# Altium schematic sheet Tag_Lastmodulation_ESP32.SchDoc
size A4; SheetNumber: 10; SheetTotal: 10
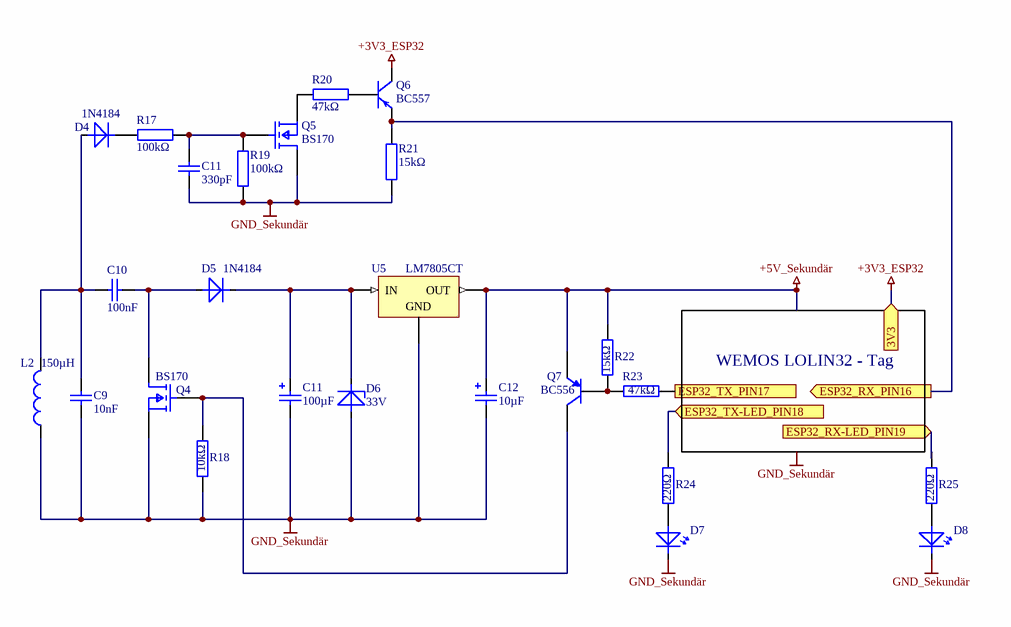
[diagram p0: Tag_Lastmodulation_ESP32.SchDoc]

## Parts
(Parts that share a designator on the sheet are numbered #1, #2 ... from top to bottom, then left to right.)
C9  value 10nF  [rad-7.2/2.5/5]  (hidden comment: KO)
C10  value 100nF  [rad-7.2/2.5/5]  (hidden comment: KO)
C11#1  value 330pF  [rad-7.2/2.5/5]  (hidden comment: KO)
C11#2  value 100µF  [RB-.1/.2]  (hidden comment: ELKO)
C12  value 10µF  [RB-.1/.2]  (hidden comment: ELKO)
D4  1N4184  [DIODE-0.6]
D5  1N4184  [DIODE-0.6]
D6  33V  [DIODE-0.4]
D7  LED  [LED-3]  (value not drawn)
D8  LED  [LED-3]  (value not drawn)
L2  value 150µH  (hidden comment: Inductor)
Q4  BS170  [FP-SOT23-IPC_A]
Q5  BS170  [FP-SOT23-IPC_A]
Q6  BC557  [TO-92/EBC]
Q7  BC556  [TO-92/EBC]
R17  value 100kΩ  [Axial-0.4]  (hidden comment: RES)
R18  value 10kΩ  [Axial-0.4]  (hidden comment: RES)
R19  value 100kΩ  [Axial-0.4]  (hidden comment: RES)
R20  value 47kΩ  [Axial-0.4]  (hidden comment: RES)
R21  value 15kΩ  [Axial-0.4]  (hidden comment: RES)
R22  value 15kΩ  [Axial-0.4]  (hidden comment: RES)
R23  value 47kΩ  [Axial-0.4]  (hidden comment: RES)
R24  value 220Ω  [Axial-0.4]  (hidden comment: RES)
R25  value 220Ω  [Axial-0.4]  (hidden comment: RES)
U5  LM7805CT  [FAIR-TO-220-3]

## Ports
3V3 (in), ESP32_RX-LED_PIN19 (in, see Lesegerät_Lastmodulation_ESP32[2C]), ESP32_RX_PIN16 (out, see Lesegerät_Lastmodulation_ESP32[2C]), ESP32_TX-LED_PIN18 (in, see Lesegerät_Lastmodulation_ESP32[2C]), ESP32_TX_PIN17 (in, see Lesegerät_Lastmodulation_ESP32[2C])

## Nets
+3V3_ESP32: Q6.3(C) ; port 3V3
+5V_Sekundär: C12.1 Q7.3(E) R22.2 U5.3(OUT)
GND_Sekundär: C9.1 C11#1.2 C11#2.2 C12.2 D6.1(A) D7.2(K) D8.2(K) L2.2 Q4.2(S) Q5.3(D) R18.1 R19.2 R21.2 U5.2(GND)
ESP32_RX-LED_PIN19: R25.2 ; port ESP32_RX-LED_PIN19
ESP32_RX_PIN16: Q6.2(E) R21.1 ; port ESP32_RX_PIN16
ESP32_TX-LED_PIN18: R24.2 ; port ESP32_TX-LED_PIN18
ESP32_TX_PIN17: R23.1 ; port ESP32_TX_PIN17
NetC9_2: C9.2 C10.2 D4.1(A) L2.1
NetC10_1: C10.1 D5.1(A) Q4.3(D)
NetC11#1_1: C11#1.1 Q5.G1(G) R17.1 R19.1
NetC11#2_1: C11#2.1 D5.2(K) D6.2(K) U5.1(IN)
NetD4_2: D4.2(K) R17.2
NetD7_1: D7.1(A) R24.1
NetD8_1: D8.1(A) R25.1
NetQ4_G1: Q4.G1(G) Q7.1(C) R18.2
NetQ5_2: Q5.2(S) R20.2
NetQ6_1: Q6.1(B) R20.1
NetQ7_2: Q7.2(B) R22.1 R23.2

## Notes on the sheet
- WEMOS LOLIN32 - Tag
- Labels drawn without touching a wire or pin: GND_Sekundär

## Library data of the parts
C9 C10 C11#1 = KO: Kondensator
D4 D5 = DIODE
D6 = Z-DIODE
D7 D8 = LED: Diode
L2 = Inductor: SimulationGenericComponent: True
Q4 Q5 = CMP-12801-000064-2: MOSFET N-CH 60V .15MA SOT23-3; On-State Resistance: 5R; Continuous Drain Current (ID): 150mA; Threshold Voltage: 3V; Number of Channels: 1; Gate to Source Voltage (Vgs): 20V; Turn-On Delay Time: 10ns; Power Dissipation: 330mW; Element Configuration: Single; Input Capacitance: 60pF; Weight: 0.000282oz; Height: 1mm; Max Operating Temperature: 150°C; Dual Supply Voltage: 60V; Termination: SMD/SMT; Number of Pins: 3; Number of Elements: 1; Mount: Surface Mount; Min Operating Temperature: -55°C; Nominal Vgs: 3V; Width: 1.4mm; Drain to Source Breakdown Voltage: 60V; Turn-Off Delay Time: 10ns; Case/Package: SOT-23; REACH SVHC: No SVHC; Packaging: Tape and Reel; Length: 3.05mm; Max Power Dissipation: 330mW; Rds On Max: 5R; Lead Free: Lead Free; Contact Plating: Tin; Drain to Source Resistance: 5R; Drain to Source Voltage (Vdss): 60V; Package Quantity: 3000; Current Rating: 150mA; Voltage Rating (DC): 60V
Q6 = PNP: Transistor
Q7 = BC556B: Amplifier Transistor PNP Silicon; pin to pad: 1>3 2>1 3>2; Published: 29-Sep-2000; LatestRevisionDate: 17-Jul-2002; LatestRevisionNote: Re-released for DXP Platform.; DatasheetVersion: 1991; PackageVersion: 1996; PackageReference: 29-04; Publisher: Altium Limited; PackageDescription: TO, Flat Index; 3 In-Line, Axial Leads; Body Dia. 4.8mm; Leads 0.48 x 0.5 mm (max); ComponentLink1Description: Manufacturer Link; ComponentLink1URL: http://www.onsemi.com/site/products/landing?taxonomyID=194; ComponentLink2Description: Datasheet; ComponentLink2URL: http://www.onsemi.com/pub/Collateral/BC556B-D.PDF
R17-R25 = RES: Widerstand
U5 = CMP-2000-04938-1: Positive Voltage Regulator, 5 V, 1 A, -40 to 125 degC, 3-Pin TO-220, RoHS, Tube; Manufacturer: FairchildSemiconductor; Maximum Input Voltage: 35V; Maximum Quiescent Current: 8mA; Load Regulation: 100mV; Maximum Output Current: 2.2(Typ)A; Output Type: Fixed; Typical Dropout Voltage @ Current: 2@1AV; Rad Hard: No; Output Voltage: 5V; Accuracy: ±4%; Number of Outputs: 1; Category: LinearRegulator; Package Description: 3-Pin Through Hole Device, Body 10 x 4.5 mm, Pitch 2.54 mm; Packaging: Rail/Tube; Mounting: ThroughHole; Polarity: Positive; Manufacturer URL: https://www.fairchildsemi.com/; Line Regulation: 100mV; Datasheet Version: Aug-12; Datasheet URL: https://datasheet.ciiva.com/26904/lm7805ct-26904988.pdf; Package Reference: TO-220; Package URL: https://www.fairchildsemi.com/package-drawings/TO/TO220B03.pdf; Package: 3TO-220AB; Operating Temperature: -40to125degC; Type: Linear